# Altium schematic sheet mcu.SchDoc
size A3; SheetNumber: 3; SheetTotal: 5
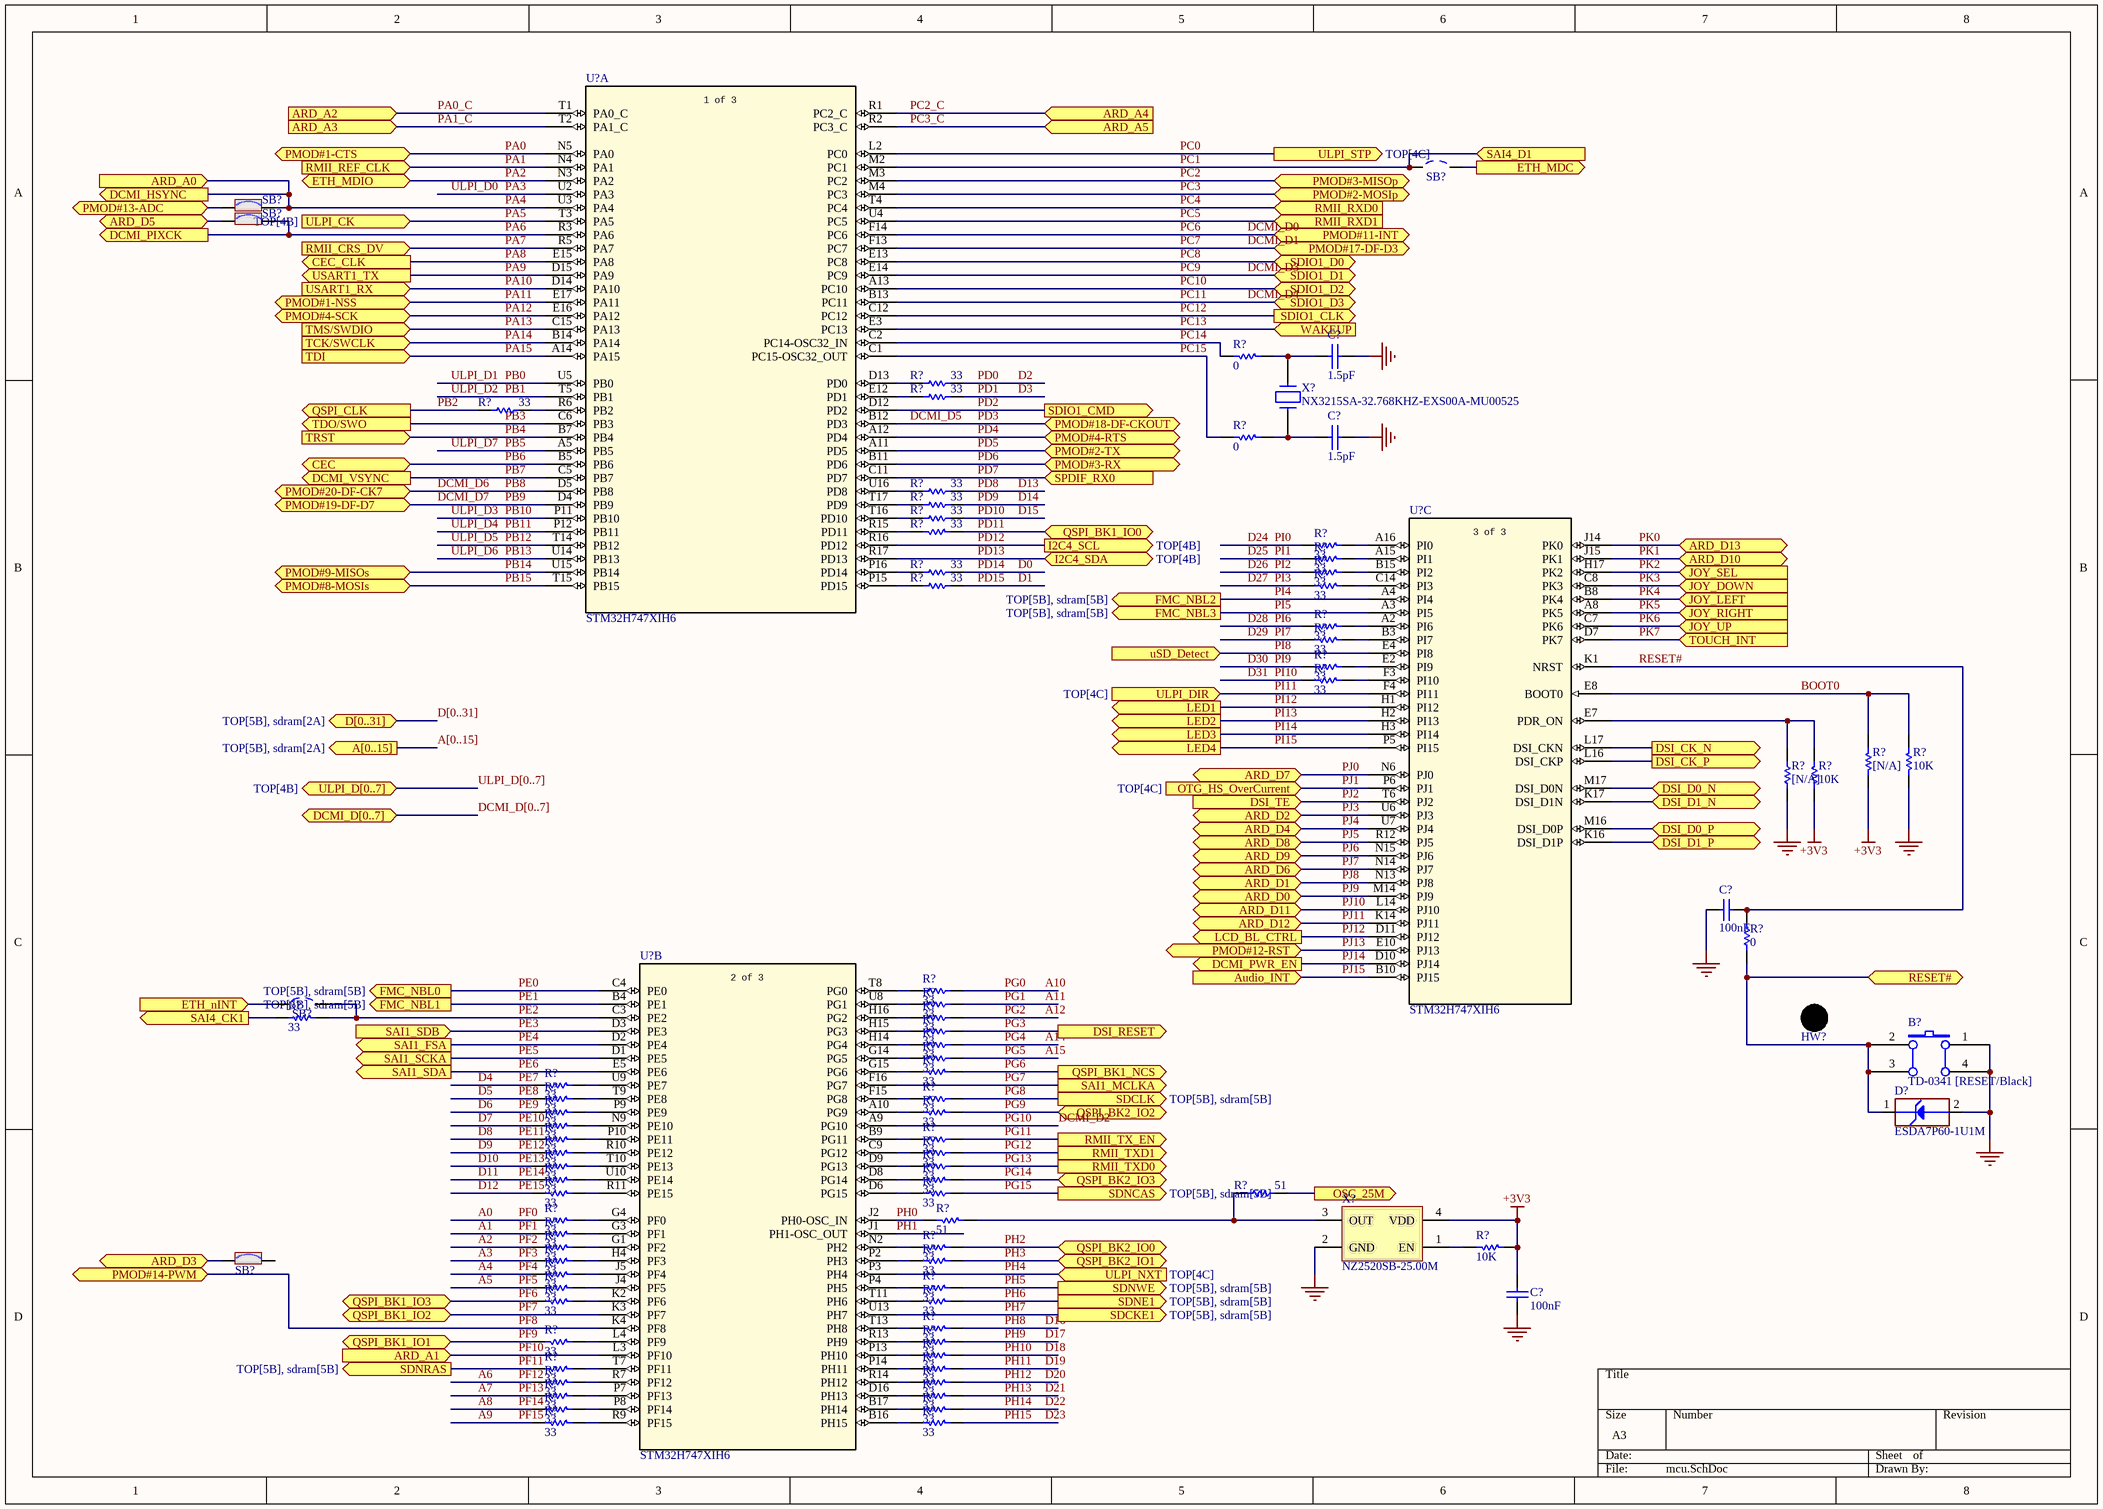
[diagram p0: mcu.SchDoc]

## Parts
(Parts that share a designator on the sheet are numbered #1, #2 ... from top to bottom, then left to right.)
B?  TD-0341 [RESET/Black]  [PB10]
C?#1  1.5pF  [CAP_C_1608X80]
C?#2  1.5pF  [CAP_C_1608X80]
C?#3  100nF  [CAP_C_1608X80]
C?#4  100nF  [CAP_C_1608X80]
D?  ESDA7P60-1U1M  [DIODE_ESDALC6V1-1U2]
HW?  SW-CAP-Black  (value not drawn)  (mechanical)
R?#1  0  [0402R]
R?#2  33  [0402R]
R?#3  33  [0402R]
R?#4  33  [0402R]
R?#5  0  [0402R]
R?#6  33  [0402R]
R?#7  33  [0402R]
R?#8  33  [0402R]
R?#9  33  [0402R]
R?#10  33  [0402R]
R?#11  33  [0402R]
R?#12  33  [0402R]
R?#13  33  [0402R]
R?#14  33  [0402R]
R?#15  33  [0402R]
R?#16  33  [0402R]
R?#17  33  [0402R]
R?#18  33  [0402R]
R?#19  33  [0402R]
R?#20  10K  [0603R]
R?#21  [N/A]  [0603R]
R?#22  [N/A]  [0603R]
R?#23  10K  [0603R]
R?#24  0  [0603R]
R?#25  33  [0402R]
R?#26  33  [0402R]
R?#27  33  [0402R]
R?#28  33  [0402R]
R?#29  33  [0402R]
R?#30  33  [0402R]
R?#31  33  [0402R]
R?#32  33  [0402R]
R?#33  33  [0402R]
R?#34  33  [0402R]
R?#35  33  [0402R]
R?#36  33  [0402R]
R?#37  33  [0402R]
R?#38  33  [0402R]
R?#39  33  [0402R]
R?#40  33  [0603R]
R?#41  33  [0402R]
R?#42  33  [0603R]
R?#43  33  [0402R]
R?#44  33  [0603R]
R?#45  33  [0402R]
R?#46  33  [0402R]
R?#47  33  [0402R]
R?#48  33  [0402R]
R?#49  51  [0603R]
R?#50  33  [0402R]
R?#51  51  [0603R]
R?#52  10K  [0603R]
R?#53  33  [0402R]
R?#54  33  [0402R]
R?#55  33  [0402R]
R?#56  33  [0402R]
R?#57  33  [0402R]
R?#58  33  [0402R]
R?#59  33  [0402R]
R?#60  33  [0402R]
R?#61  33  [0402R]
R?#62  33  [0402R]
R?#63  33  [0402R]
R?#64  33  [0402R]
R?#65  33  [0402R]
R?#66  33  [0402R]
R?#67  33  [0402R]
R?#68  33  [0402R]
R?#69  33  [0402R]
R?#70  33  [0402R]
R?#71  33  [0402R]
R?#72  33  [0402R]
R?#73  33  [0402R]
R?#74  33  [0402R]
R?#75  33  [0402R]
R?#76  33  [0402R]
SB?#1  Solder Bridge OFF  [SB_0603]  (value not drawn)
SB?#2  Solder Bridge ON  [Jump2]  (value not drawn)
SB?#3  Solder Bridge ON  [Jump2]  (value not drawn)
SB?#4  Solder Bridge OFF  [SB_0603]  (value not drawn)
SB?#5  Solder Bridge ON  [Jump2]  (value not drawn)
U?#1  STM32H747XIH6  [TFBGA240+25]  (part A of 4)
U?#2  STM32H747XIH6  [TFBGA240+25]  (part C of 4)
U?#3  STM32H747XIH6  [TFBGA240+25]  (part B of 4)
X?#1  NX3215SA-32.768KHZ-EXS00A-MU00525  [XTAL_MU00525_NDK]
X?#2  NZ2520SB-25.00M  [OSC_4SM_2R5X2]

## Ports
A[0..15] (out, see TOP[5B], sdram[2A]), ARD_A0 (in), ARD_A1 (in), ARD_A2 (in), ARD_A3 (in), ARD_A4 (in), ARD_A5 (in), ARD_D0 (bidir), ARD_D1 (bidir), ARD_D2 (bidir), ARD_D3 (bidir), ARD_D4 (bidir), ARD_D5 (bidir), ARD_D6 (bidir), ARD_D7 (bidir), ARD_D8 (bidir), ARD_D9 (bidir), ARD_D10 (bidir), ARD_D11 (bidir), ARD_D12 (bidir), ARD_D13 (bidir), Audio_INT (in), CEC (bidir), CEC_CLK (out), D[0..31] (bidir, see TOP[5B], sdram[2A]), DCMI_D[0..7] (bidir), DCMI_HSYNC (out), DCMI_PIXCK (out), DCMI_PWR_EN (out), DCMI_VSYNC (out), DSI_CK_N (out), DSI_CK_P (out), DSI_D0_N (bidir), DSI_D0_P (bidir), DSI_D1_N (bidir), DSI_D1_P (bidir), DSI_RESET (out), DSI_TE (in), ETH_MDC (out), ETH_MDIO (bidir), ETH_nINT (in), FMC_NBL0 (out, see TOP[5B], sdram[5B]), FMC_NBL1 (out, see TOP[5B], sdram[5B]), FMC_NBL2 (out, see TOP[5B], sdram[5B]), FMC_NBL3 (out, see TOP[5B], sdram[5B]), I2C4_SCL (out, see TOP[4B]), I2C4_SDA (bidir, see TOP[4B]), JOY_DOWN (in), JOY_LEFT (in), JOY_RIGHT (in), JOY_SEL (in), JOY_UP (in), LCD_BL_CTRL (out), LED1 (out), LED2 (out), LED3 (out), LED4 (out), OSC_25M (out), OTG_HS_OverCurrent (in, see TOP[4C]), PMOD#1-CTS (bidir), PMOD#1-NSS (bidir), PMOD#2-MOSIp (bidir), PMOD#2-TX (bidir), PMOD#3-MISOp (bidir), PMOD#3-RX (bidir), PMOD#4-RTS (bidir), PMOD#4-SCK (bidir), PMOD#8-MOSIs (bidir), PMOD#9-MISOs (bidir), PMOD#11-INT (bidir), PMOD#12-RST (bidir), PMOD#13-ADC (bidir), PMOD#14-PWM (bidir), PMOD#17-DF-D3 (bidir), PMOD#18-DF-CKOUT (bidir), PMOD#19-DF-D7 (bidir), PMOD#20-DF-CK7 (bidir), QSPI_BK1_IO0 (bidir), QSPI_BK1_IO1 (bidir), QSPI_BK1_IO2 (bidir), QSPI_BK1_IO3 (bidir), QSPI_BK1_NCS (out), QSPI_BK2_IO0 (bidir), QSPI_BK2_IO1 (bidir), QSPI_BK2_IO2 (bidir), QSPI_BK2_IO3 (bidir), QSPI_CLK (out), RESET# (bidir), RMII_CRS_DV (in), RMII_REF_CLK (in), RMII_RXD0 (in), RMII_RXD1 (in), RMII_TX_EN (out), RMII_TXD0 (out), RMII_TXD1 (out), SAI1_FSA (out), SAI1_MCLKA (out), SAI1_SCKA (out), SAI1_SDA (out), SAI1_SDB (in), SAI4_CK1 (out), SAI4_D1 (in), SDCKE1 (out, see TOP[5B], sdram[5B]), SDCLK (out, see TOP[5B], sdram[5B]), SDIO1_CLK (out), SDIO1_CMD (out), SDIO1_D0 (bidir), SDIO1_D1 (bidir), SDIO1_D2 (bidir), SDIO1_D3 (bidir), SDNCAS (out, see TOP[5B], sdram[5B]), SDNE1 (out, see TOP[5B], sdram[5B]), SDNRAS (out, see TOP[5B], sdram[5B]), SDNWE (out, see TOP[5B], sdram[5B]), SPDIF_RX0 (in), TCK/SWCLK (in), TDI (in), TDO/SWO (out), TMS/SWDIO (in), TOUCH_INT (in), TRST (in), ULPI_CK (in, see TOP[4B]), ULPI_D[0..7] (bidir, see TOP[4B]), ULPI_DIR (in, see TOP[4C]), ULPI_NXT (in, see TOP[4C]), ULPI_STP (out, see TOP[4C]), USART1_RX (in), USART1_TX (out), uSD_Detect (in), WAKEUP (in)

## Nets
+3V3: C?#4.2 R?#22.1 R?#23.1 R?#52.1 X?#2.4(VDD)
GND: B?.1(A0) B?.4(A1) C?#1.2 C?#2.2 C?#3.1 C?#4.1 D?.2(GND) R?#20.2 R?#21.2 X?#2.2(GND)
A0: R?#50.1  [also labelled PF0]
A1: R?#53.1  [also labelled PF1]
A2: R?#54.1  [also labelled PF2]
A3: R?#56.1  [also labelled PF3]
A4: R?#58.1  [also labelled PF4]
A5: R?#59.1  [also labelled PF5]
A6: R?#69.1  [also labelled PF12]
A7: R?#71.1  [also labelled PF13]
A8: R?#73.1  [also labelled PF14]
A9: R?#75.1  [also labelled PF15]
A10: R?#25.1  [also labelled PG0]
A11: R?#26.1  [also labelled PG1]
A12: R?#28.1  [also labelled PG2]
A14: R?#30.1  [also labelled PG4]
A15: R?#31.1  [also labelled PG5]
ARD_D3: SB?#5.2 ; port ARD_D3
ARD_D5: SB?#3.1 ; port ARD_D5
BOOT0: R?#20.1 R?#22.2 U?#2.E8(BOOT0)
D0: R?#12.1  [also labelled PD14]
D1: R?#14.1  [also labelled PD15]
D2: R?#2.1  [also labelled PD0]
D3: R?#3.1  [also labelled PD1]
D4: R?#33.1  [also labelled PE7]
D5: R?#34.1  [also labelled PE8]
D6: R?#36.1  [also labelled PE9]
D7: R?#38.1  [also labelled PE10]
D8: R?#39.1  [also labelled PE11]
D9: R?#41.1  [also labelled PE12]
D10: R?#43.1  [also labelled PE13]
D11: R?#45.1  [also labelled PE14]
D12: R?#47.1  [also labelled PE15]
D13: R?#6.1  [also labelled PD8]
D14: R?#7.1  [also labelled PD9]
D15: R?#8.1  [also labelled PD10]
D16: R?#63.2  [also labelled PH8]
D17: R?#65.2  [also labelled PH9]
D18: R?#66.2  [also labelled PH10]
D19: R?#68.2  [also labelled PH11]
D20: R?#70.2  [also labelled PH12]
D21: R?#72.2  [also labelled PH13]
D22: R?#74.2  [also labelled PH14]
D23: R?#76.2  [also labelled PH15]
D24: R?#10.1  [also labelled PI0]
D25: R?#11.1  [also labelled PI1]
D26: R?#13.1  [also labelled PI2]
D27: R?#15.1  [also labelled PI3]
D28: R?#16.1  [also labelled PI6]
D29: R?#17.1  [also labelled PI7]
D30: R?#18.1  [also labelled PI9]
D31: R?#19.1  [also labelled PI10]
DCMI_D0: U?#1.F14(PC6) ; port PMOD#11-INT  [also labelled PC6]
DCMI_D1: U?#1.F13(PC7) ; port PMOD#17-DF-D3  [also labelled PC7]
DCMI_D2: U?#3.A9(PG10)  [also labelled PG10]
DCMI_D3: U?#1.E14(PC9) ; port SDIO1_D1  [also labelled PC9]
DCMI_D4: U?#1.B13(PC11) ; port SDIO1_D3  [also labelled PC11]
DCMI_D5: U?#1.B12(PD3) ; port PMOD#18-DF-CKOUT  [also labelled PD3]
DCMI_D6: U?#1.D5(PB8) ; port PMOD#20-DF-CK7  [also labelled PB8]
DCMI_D7: U?#1.D4(PB9) ; port PMOD#19-DF-D7  [also labelled PB9]
DSI_CK_N: U?#2.L17(DSI_CKN) ; port DSI_CK_N
DSI_CK_P: U?#2.L16(DSI_CKP) ; port DSI_CK_P
DSI_D0_N: U?#2.M17(DSI_D0N) ; port DSI_D0_N
DSI_D0_P: U?#2.M16(DSI_D0P) ; port DSI_D0_P
DSI_D1_N: U?#2.K17(DSI_D1N) ; port DSI_D1_N
DSI_D1_P: U?#2.K16(DSI_D1P) ; port DSI_D1_P
ETH_MDC: SB?#1.1 ; port ETH_MDC
ETH_nINT: SB?#4.2 ; port ETH_nINT
OSC_25M: R?#49.1 ; port OSC_25M
PA0: U?#1.N5(PA0) ; port PMOD#1-CTS
PA0_C: U?#1.T1(PA0_C) ; port ARD_A2
PA1: U?#1.N4(PA1) ; port RMII_REF_CLK
PA1_C: U?#1.T2(PA1_C) ; port ARD_A3
PA2: U?#1.N3(PA2) ; port ETH_MDIO
PA3: U?#1.U2(PA3)  [also labelled ULPI_D0]
PA4: SB?#2.2 U?#1.U3(PA4) ; port DCMI_HSYNC, port ARD_A0
PA5: U?#1.T3(PA5) ; port ULPI_CK
PA6: SB?#3.2 U?#1.R3(PA6) ; port DCMI_PIXCK
PA7: U?#1.R5(PA7) ; port RMII_CRS_DV
PA8: U?#1.E15(PA8) ; port CEC_CLK
PA9: U?#1.D15(PA9) ; port USART1_TX
PA10: U?#1.D14(PA10) ; port USART1_RX
PA11: U?#1.E17(PA11) ; port PMOD#1-NSS
PA12: U?#1.E16(PA12) ; port PMOD#4-SCK
PA13: U?#1.C15(PA13) ; port TMS/SWDIO
PA14: U?#1.B14(PA14) ; port TCK/SWCLK
PA15: U?#1.A14(PA15) ; port TDI
PB0: U?#1.U5(PB0)  [also labelled ULPI_D1]
PB1: U?#1.T5(PB1)  [also labelled ULPI_D2]
PB2: R?#4.2 ; port QSPI_CLK
PB3: U?#1.C6(PB3) ; port TDO/SWO
PB4: U?#1.B7(PB4) ; port TRST
PB5: U?#1.A5(PB5)  [also labelled ULPI_D7]
PB6: U?#1.B5(PB6) ; port CEC
PB7: U?#1.C5(PB7) ; port DCMI_VSYNC
PB10: U?#1.P11(PB10)  [also labelled ULPI_D3]
PB11: U?#1.P12(PB11)  [also labelled ULPI_D4]
PB12: U?#1.T14(PB12)  [also labelled ULPI_D5]
PB13: U?#1.U14(PB13)  [also labelled ULPI_D6]
PB14: U?#1.U15(PB14) ; port PMOD#9-MISOs
PB15: U?#1.T15(PB15) ; port PMOD#8-MOSIs
PC0: U?#1.L2(PC0) ; port ULPI_STP
PC1: SB?#1.2 U?#1.M2(PC1) ; port SAI4_D1
PC2: U?#1.M3(PC2) ; port PMOD#3-MISOp
PC2_C: U?#1.R1(PC2_C) ; port ARD_A4
PC3: U?#1.M4(PC3) ; port PMOD#2-MOSIp
PC3_C: U?#1.R2(PC3_C) ; port ARD_A5
PC4: U?#1.T4(PC4) ; port RMII_RXD0
PC5: U?#1.U4(PC5) ; port RMII_RXD1
PC8: U?#1.E13(PC8) ; port SDIO1_D0
PC10: U?#1.A13(PC10) ; port SDIO1_D2
PC12: U?#1.C12(PC12) ; port SDIO1_CLK
PC13: U?#1.E3(PC13) ; port WAKEUP
PC14: R?#1.2 U?#1.C2(PC14-OSC32_IN)
PC15: R?#5.2 U?#1.C1(PC15-OSC32_OUT)
PD2: U?#1.D12(PD2) ; port SDIO1_CMD
PD4: U?#1.A12(PD4) ; port PMOD#4-RTS
PD5: U?#1.A11(PD5) ; port PMOD#2-TX
PD6: U?#1.B11(PD6) ; port PMOD#3-RX
PD7: U?#1.C11(PD7) ; port SPDIF_RX0
PD11: R?#9.2 ; port QSPI_BK1_IO0
PD12: U?#1.R16(PD12) ; port I2C4_SCL
PD13: U?#1.R17(PD13) ; port I2C4_SDA
PE0: U?#3.C4(PE0) ; port FMC_NBL0
PE1: U?#3.B4(PE1) ; port FMC_NBL1
PE2: R?#27.2 SB?#4.1 U?#3.C3(PE2)
PE3: U?#3.D3(PE3) ; port SAI1_SDB
PE4: U?#3.D2(PE4) ; port SAI1_FSA
PE5: U?#3.D1(PE5) ; port SAI1_SCKA
PE6: U?#3.E5(PE6) ; port SAI1_SDA
PF6: R?#61.1 ; port QSPI_BK1_IO3
PF7: U?#3.K3(PF7) ; port QSPI_BK1_IO2
PF8: U?#3.K4(PF8) ; port PMOD#14-PWM
PF9: R?#64.1 ; port QSPI_BK1_IO1
PF10: U?#3.L3(PF10) ; port ARD_A1
PF11: R?#67.1 ; port SDNRAS
PG3: R?#29.1 ; port DSI_RESET
PG6: R?#32.2 ; port QSPI_BK1_NCS
PG7: U?#3.F16(PG7) ; port SAI1_MCLKA
PG8: R?#35.1 ; port SDCLK
PG9: R?#37.2 ; port QSPI_BK2_IO2
PG11: R?#40.1 ; port RMII_TX_EN
PG12: R?#42.1 ; port RMII_TXD1
PG13: R?#44.1 ; port RMII_TXD0
PG14: R?#46.2 ; port QSPI_BK2_IO3
PG15: R?#48.1 ; port SDNCAS
PH0: R?#51.1 U?#3.J2(PH0-OSC_IN)
PH1: U?#3.J1(PH1-OSC_OUT)
PH2: R?#55.2 ; port QSPI_BK2_IO0
PH3: R?#57.2 ; port QSPI_BK2_IO1
PH4: U?#3.P3(PH4) ; port ULPI_NXT
PH5: R?#60.2 ; port SDNWE
PH6: R?#62.2 ; port SDNE1
PH7: U?#3.U13(PH7) ; port SDCKE1
PI4: U?#2.A4(PI4) ; port FMC_NBL2
PI5: U?#2.A3(PI5) ; port FMC_NBL3
PI8: U?#2.E4(PI8) ; port uSD_Detect
PI11: U?#2.F4(PI11) ; port ULPI_DIR
PI12: U?#2.H1(PI12) ; port LED1
PI13: U?#2.H2(PI13) ; port LED2
PI14: U?#2.H3(PI14) ; port LED3
PI15: U?#2.P5(PI15) ; port LED4
PJ0: U?#2.N6(PJ0) ; port ARD_D7
PJ1: U?#2.P6(PJ1) ; port OTG_HS_OverCurrent
PJ2: U?#2.T6(PJ2) ; port DSI_TE
PJ3: U?#2.U6(PJ3) ; port ARD_D2
PJ4: U?#2.U7(PJ4) ; port ARD_D4
PJ5: U?#2.R12(PJ5) ; port ARD_D8
PJ6: U?#2.N15(PJ6) ; port ARD_D9
PJ7: U?#2.N14(PJ7) ; port ARD_D6
PJ8: U?#2.N13(PJ8) ; port ARD_D1
PJ9: U?#2.M14(PJ9) ; port ARD_D0
PJ10: U?#2.L14(PJ10) ; port ARD_D11
PJ11: U?#2.K14(PJ11) ; port ARD_D12
PJ12: U?#2.D11(PJ12) ; port LCD_BL_CTRL
PJ13: U?#2.E10(PJ13) ; port PMOD#12-RST
PJ14: U?#2.D10(PJ14) ; port DCMI_PWR_EN
PJ15: U?#2.B10(PJ15) ; port Audio_INT
PK0: U?#2.J14(PK0) ; port ARD_D13
PK1: U?#2.J15(PK1) ; port ARD_D10
PK2: U?#2.H17(PK2) ; port JOY_SEL
PK3: U?#2.C8(PK3) ; port JOY_DOWN
PK4: U?#2.B8(PK4) ; port JOY_LEFT
PK5: U?#2.A8(PK5) ; port JOY_RIGHT
PK6: U?#2.C7(PK6) ; port JOY_UP
PK7: U?#2.D7(PK7) ; port TOUCH_INT
PMOD#13-ADC: SB?#2.1 ; port PMOD#13-ADC
RESET#: B?.2(B0) B?.3(B1) D?.1(IO1) R?#24.2 ; port RESET#
RESET#: C?#3.2 R?#24.1 U?#2.K1(NRST)  [a separate net that carries the same name]
SAI4_CK1: R?#27.1 ; port SAI4_CK1
NetC?#1_1: C?#1.1 R?#1.1 X?#1.2
NetC?#2_1: C?#2.1 R?#5.1 X?#1.1
NetR?#2_2: R?#2.2 U?#1.D13(PD0)
NetR?#3_2: R?#3.2 U?#1.E12(PD1)
NetR?#4_1: R?#4.1 U?#1.R6(PB2)
NetR?#6_2: R?#6.2 U?#1.U16(PD8)
NetR?#7_2: R?#7.2 U?#1.T17(PD9)
NetR?#8_2: R?#8.2 U?#1.T16(PD10)
NetR?#9_1: R?#9.1 U?#1.R15(PD11)
NetR?#10_2: R?#10.2 U?#2.A16(PI0)
NetR?#11_2: R?#11.2 U?#2.A15(PI1)
NetR?#12_2: R?#12.2 U?#1.P16(PD14)
NetR?#13_2: R?#13.2 U?#2.B15(PI2)
NetR?#14_2: R?#14.2 U?#1.P15(PD15)
NetR?#15_2: R?#15.2 U?#2.C14(PI3)
NetR?#16_2: R?#16.2 U?#2.A2(PI6)
NetR?#17_2: R?#17.2 U?#2.B3(PI7)
NetR?#18_2: R?#18.2 U?#2.E2(PI9)
NetR?#19_2: R?#19.2 U?#2.F3(PI10)
NetR?#21_1: R?#21.1 R?#23.2 U?#2.E7(PDR_ON)
NetR?#25_2: R?#25.2 U?#3.T8(PG0)
NetR?#26_2: R?#26.2 U?#3.U8(PG1)
NetR?#28_2: R?#28.2 U?#3.H16(PG2)
NetR?#29_2: R?#29.2 U?#3.H15(PG3)
NetR?#30_2: R?#30.2 U?#3.H14(PG4)
NetR?#31_2: R?#31.2 U?#3.G14(PG5)
NetR?#32_1: R?#32.1 U?#3.G15(PG6)
NetR?#33_2: R?#33.2 U?#3.U9(PE7)
NetR?#34_2: R?#34.2 U?#3.T9(PE8)
NetR?#35_2: R?#35.2 U?#3.F15(PG8)
NetR?#36_2: R?#36.2 U?#3.P9(PE9)
NetR?#37_1: R?#37.1 U?#3.A10(PG9)
NetR?#38_2: R?#38.2 U?#3.N9(PE10)
NetR?#39_2: R?#39.2 U?#3.P10(PE11)
NetR?#40_2: R?#40.2 U?#3.B9(PG11)
NetR?#41_2: R?#41.2 U?#3.R10(PE12)
NetR?#42_2: R?#42.2 U?#3.C9(PG12)
NetR?#43_2: R?#43.2 U?#3.T10(PE13)
NetR?#44_2: R?#44.2 U?#3.D9(PG13)
NetR?#45_2: R?#45.2 U?#3.U10(PE14)
NetR?#46_1: R?#46.1 U?#3.D8(PG14)
NetR?#47_2: R?#47.2 U?#3.R11(PE15)
NetR?#48_2: R?#48.2 U?#3.D6(PG15)
NetR?#49_2: R?#49.2 R?#51.2 X?#2.3(OUT)
NetR?#50_2: R?#50.2 U?#3.G4(PF0)
NetR?#52_2: R?#52.2 X?#2.1(EN)
NetR?#53_2: R?#53.2 U?#3.G3(PF1)
NetR?#54_2: R?#54.2 U?#3.G1(PF2)
NetR?#55_1: R?#55.1 U?#3.N2(PH2)
NetR?#56_2: R?#56.2 U?#3.H4(PF3)
NetR?#57_1: R?#57.1 U?#3.P2(PH3)
NetR?#58_2: R?#58.2 U?#3.J5(PF4)
NetR?#59_2: R?#59.2 U?#3.J4(PF5)
NetR?#60_1: R?#60.1 U?#3.P4(PH5)
NetR?#61_2: R?#61.2 U?#3.K2(PF6)
NetR?#62_1: R?#62.1 U?#3.T11(PH6)
NetR?#63_1: R?#63.1 U?#3.T13(PH8)
NetR?#64_2: R?#64.2 U?#3.L4(PF9)
NetR?#65_1: R?#65.1 U?#3.R13(PH9)
NetR?#66_1: R?#66.1 U?#3.P13(PH10)
NetR?#67_2: R?#67.2 U?#3.T7(PF11)
NetR?#68_1: R?#68.1 U?#3.P14(PH11)
NetR?#69_2: R?#69.2 U?#3.R7(PF12)
NetR?#70_1: R?#70.1 U?#3.R14(PH12)
NetR?#71_2: R?#71.2 U?#3.P7(PF13)
NetR?#72_1: R?#72.1 U?#3.D16(PH13)
NetR?#73_2: R?#73.2 U?#3.P8(PF14)
NetR?#74_1: R?#74.1 U?#3.B17(PH14)
NetR?#75_2: R?#75.2 U?#3.R9(PF15)
NetR?#76_1: R?#76.1 U?#3.B16(PH15)

Not connected (* = marked no-connect by the designer): SB?#5 1

## Buses and harness runs
bus A[0..15] = port A[0..15]
bus D[0..31] = port D[0..31]
bus DCMI_D[0..7] = port DCMI_D[0..7]
bus ULPI_D[0..7] = port ULPI_D[0..7]

## Notes on the sheet
- (in symbol STM32H747XIH6, part A) 1 of 3
- (in symbol STM32H747XIH6, part B) 2 of 3
- (in symbol STM32H747XIH6, part C) 3 of 3

## Library data of the parts
B? = SW PUSHBUTTON: SE PUSHBUTTON
C?#1 C?#2 C?#4 = CAP: Capacitor
  C?#4: Published: 8-Jun-2000; Revision: July-2002: Re-released for DXP Platform.; Publisher: Altium Limited; Value: 100nF
C?#3 = CAP: Capacitor; Value: 100pF; Published: 8-Jun-2000; Revision: July-2002: Re-released for DXP Platform.; Publisher: Altium Limited
D? = ESDALC6V1-1U2: Dual Transil array for ESD protection; Manuf_1: STM; Ref St: .; ECCN_US/EU: EAR99/NEC; Fitted: YES; Provided: ST; Manuf_Part_1: ESDA7P60-1U1M; Distrib: ST; Ordered by: STM; Order: ESDA7P60-1U1M
HW? = MCD-02420: Black round cap for TSS6x series; Part_Type: Mechanical; Part_Preference: Recommended; Manufacturer: KNITTER-SWITCH; Manufacturer_Part_Number: KTSC-62K; Manufacturer_HQ_COO: Unknown; Partial_Alternate_Internal_Part_Number: MCD-02526; Value: SW-CAP-KTSC-62K; Component_Country_Of_Origin: China; Alternate_EMS: M; ShowFields: YES; ID: 4526; Order_code_Digikey: N/A; Order_code_Farnell: N/A; Order_code_RS: N/A; Status: Released; ComponentLink1URL: http://tunmcdsvn.tun.st.com/Component_Documentation_Library/Trunk/Mechanical/KNITTER_SWITCH_KTSC-62_Series; Internal_Part_Number: MCD-02420
R?#1-R?#19 R?#23 R?#25-R?#51 R?#53-R?#76 = Res1: Resistor; Value: 1K; Published: 8-Jun-2000; Revision: July-2002: Re-released for DXP Platform.; Publisher: Altium Limited
R?#20 R?#24 = res1: Resistor; Value: 1K; Published: 8-Jun-2000; Revision: July-2002: Re-released for DXP Platform.; Publisher: Altium Limited
R?#21 R?#22 = res1: Resistor; Value: 1K; Ordered by: Subcon; ECCN_US/EU: NA; Fitted: NO; Published: 8-Jun-2000; Revision: July-2002: Re-released for DXP Platform.; Publisher: Altium Limited
R?#52 = Res_10K_1%_0402: Resistor,10K,0402,1%,YAGEO; Value: 10K; Manuf_1: YAGEO; ECCN_US/EU: n/a
SB?#1 SB?#4 = SB_OFF: Fitted: NO; Ordered by: Subcon; Revision: July-2002: Re-released for DXP Platform.; ECCN_US/EU: n/a
SB?#2 SB?#3 SB?#5 = SB_ON: Fitted: YES; Ordered by: Subcon; Revision: July-2002: Re-released for DXP Platform.; ECCN_US/EU: n/a
U?#1-U?#3 = STM32H747XIH6: High-performance and DSP with DP-FPU, Arm Cortex-M7 + Cortex-M4 MCU with 2MBytes of Flash memory, 1MB RAM, 480 MHz CPU, Art Accelerator, L1 cache, external memory interface, large set of peripherals, SMPS; Manufacturer_Name: STMicroelectronics; Copyright: Copyright (C) 2025 Ultra Librarian. All rights reserved.; Manufacturer_Part_Number: STM32H747XIH6; Datasheet: https://www.st.com/resource/en/datasheet/stm32h747ag.pdf; RefDes: RefDes; Type: Type
X?#1 = CRYSTAL_32K: Crystal; Manuf_1: NDK; ECCN_US/EU: EAR99/NEC; Ordered by: STM; Fitted: YES; Manuf_Part_1: NX3215SA-32.768KHZ-EXS00A-MU00525
X?#2 = OSC_25M_NZ2520SB: Oscillator 25.00Mhz, -+50PPM, 3.3V, Temp -55 to +125癈; Manuf_Part_1: NZ2520SB 25MHz END4869B; Manuf_1: NDK; Manuf_Part_2: KC2520B25.0000C10E00; Manuf_2: AVX Corp/Kyocera Corp; Ordered by: STM; ECCN_US/EU: EAR99/NEC; Ref St: 9157031; Fitted: YES